# Altium schematic sheet Schematic.SchDoc
size A4
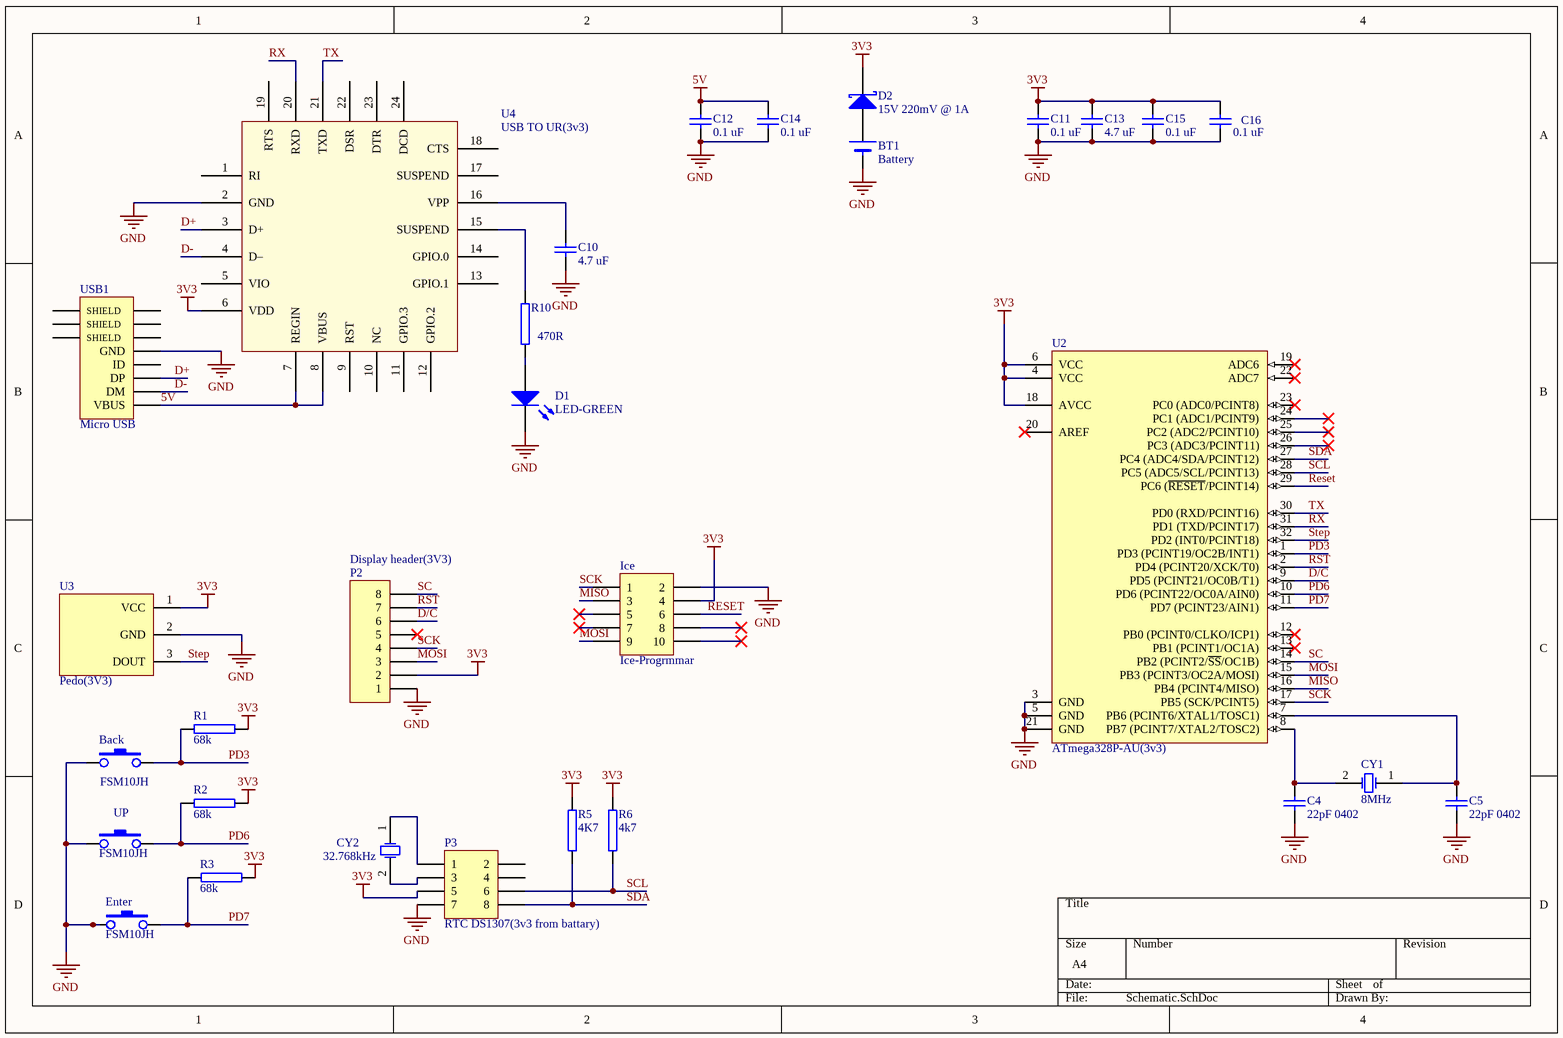
[diagram p0: Schematic.SchDoc]

## Parts
Back  FSM10JH  [FSM10JH]
BT1  Battery  [SMTU 2430-1-LF]
C4  22pF 0402  [CAP_0805]
C5  22pF 0402  [CAP_0805]
C10  4.7 uF  [CAP_0805]
C11  0.1 uF  [CAP_0805]
C12  0.1 uF  [CAP_0805]
C13  4.7 uF  [CAP_0805]
C14  0.1 uF  [CAP_0805]
C15  0.1 uF  [CAP_0805]
C16  0.1 uF  [CAP_0805]
CY1  8MHz  [ABM3]
CY2  32.768kHz  [ABM3]
D1  LED-GREEN  [CAP_0805]
D2  15V 220mV @ 1A  [SOD-128]
Enter  FSM10JH  [FSM10JH]
Ice  Ice-Progrmmar  [SHF-105-01-L-D]
P2  Display header(3V3)  [HDR1X8_AUT]
P3  RTC DS1307(3v3 from battary)  [DIP-8AUT]
R1  68k  [CAP_0805]
R2  68k  [CAP_0805]
R3  68k  [CAP_0805]
R5  4K7  [CAP_0805]
R6  4k7  [CAP_0805]
R10  470R  [CAP_0805]
U2  ATmega328P-AU(3v3)  [32A_M]
U3  Pedo(3V3)  [PCBComponent_1]
U4  USB TO UR(3v3)  [USB_TO_UR_CP1024]
UP  FSM10JH  [FSM10JH]
USB1  Micro USB  [USB-MICRO-B]

## Nets
3V3: C11.2 C13.2 C15.2 C16.2 D2.K Ice.4 P2.2 P3.5 R1.2 R2.2 R3.2 R5.2 R6.2 U2.4(VCC) U2.6(VCC) U2.18(AVCC) U3.1(VCC) U4.6(VDD)
5V: C12.2 C14.2 U4.7(REGIN) U4.8(VBUS) USB1.1(VBUS)
GND: Back.1 BT1.2 C4.1 C5.1 C10.1 C11.1 C12.1 C13.1 C14.1 C15.1 C16.1 D1.K Enter.1 Ice.2 P2.1 P3.7 U2.3(GND) U2.5(GND) U2.21(GND) U3.2(GND) U4.2(GND) UP.1 USB1.5(GND)
D+: U4.3(D+) USB1.3(DP)
D-: U4.4(D–) USB1.2(DM)
D/C: P2.6 U2.9(PD5_(PCINT21/OC0B/T1))
MISO: Ice.3 U2.16(PB4_(PCINT4/MISO))
MOSI: Ice.9 P2.3 U2.15(PB3_(PCINT3/OC2A/MOSI))
PD3: Back.2 R1.1 U2.1(PD3_(PCINT19/OC2B/INT1))
PD6: R2.1 U2.10(PD6_(PCINT22/OC0A/AIN0)) UP.2
PD7: Enter.2 R3.1 U2.11(PD7_(PCINT23/AIN1))
Reset: Ice.6 U2.29(PC6_(~{RESET}/PCINT14))
RST: P2.7 U2.2(PD4_(PCINT20/XCK/T0))
RX: U2.31(PD1_(TXD/PCINT17)) U4.20(RXD)
SC: P2.8 U2.14(PB2_(PCINT2/~{SS}/OC1B))
SCK: Ice.1 P2.4 U2.17(PB5_(SCK/PCINT5))
SCL: P3.6 R6.1 U2.28(PC5_(ADC5/SCL/PCINT13))
SDA: P3.8 R5.1 U2.27(PC4_(ADC4/SDA/PCINT12))
Step: U2.32(PD2_(INT0/PCINT18)) U3.3(DOUT)
TX: U2.30(PD0_(RXD/PCINT16)) U4.21(TXD)
NetC4_2: C4.2 CY1.2(OSC2) U2.8(PB7_(PCINT7/XTAL2/TOSC2))
NetC5_2: C5.2 CY1.1(OSC1) U2.7(PB6_(PCINT6/XTAL1/TOSC1))
NetC10_2: C10.2 U4.16(VPP)
NetCY2_1: CY2.1(OSC1) P3.1
NetCY2_2: CY2.2(OSC2) P3.3
NetD1_A: D1.A R10.1
NetR10_2: R10.2 U4.15(SUSPEND)

Not connected (* = marked no-connect by the designer): BT1 1; D2 A; Ice 5* 7* 8* 10*; P2 5*; P3 2 4; U2 12(PB0_(PCINT0/CLKO/ICP1))* 13(PB1_(PCINT1/OC1A))* 19(ADC6)* 20(AREF)* 22(ADC7)* 23(PC0_(ADC0/PCINT8))* 24(PC1_(ADC1/PCINT9))* 25(PC2_(ADC2/PCINT10))* 26(PC3_(ADC3/PCINT11))*; U4 1(RI) 5(VIO) 9(RST) 10(NC) 11(GPIO.3) 12(GPIO.2) 13(GPIO.1) 14(GPIO.0) 17(SUSPEND) 18(CTS) 19(RTS) 22(DSR) 23(DTR) 24(DCD); USB1 4(ID) 6(SHIELD) 7(SHIELD) 8(SHIELD) 9(SHIELD) 10(SHIELD) 11(SHIELD)

## Library data of the parts
Back Enter UP = FSM10JH: Switch, SPST, 0.05A, 12VDC; Supplier 1: Element14; Supplier Part Number 1: 1555986; SMD: no
BT1 = SMTU 2430-1-LF: HOLDER, SMD BATTERY, FOR CR 2430; Battary: CR2430; Supplier 1: Element14; Supplier Part Number 1: 1216355; SMD: yes
C4 C5 = CAPN 0402: Non Polarized Capacitor, SMD, 0402; Digi-Key Part Number: 399-1113-2-ND; SMD: yes; Supplier 1: Digi-Key; Supplier Part Number 1: 399-1113-2-ND
C10-C16 = CAPN 1206: Non Polarized Capacitor, SMD, 1206; SMD: yes; Footprint: 1206; Supplier 1: Digi-Key
  C10 C13: Digikey Parts Number: *; Supplier Part Number 1: 587-1297-1-ND; Digi-Key Part Number: 587-1297-1-ND
  C11 C12 C14-C16: Supplier Part Number 1: 1276-1007-1-ND; Digi-Key Part Number: 1276-1007-1-ND
CY1 CY2 = ABM3-12.000MHZ-D2Y-T: CRYSTAL, 12MHZ, 18PF, SMD; SMD: yes; Supplier 1: Digi-Key
  CY1: Digi-Key Part Number: 644-1178-1-ND; Supplier Part Number 1: 644-1178-1-ND
  CY2: Digi-Key Part Number: 535-11899-1-ND; Supplier Part Number 1: 535-11899-1-ND
D1 = SMD 0805 LED-GREEN: GREEN  LED,Case 0805; Supplier 1: Digi-Key; Supplier Part Number 1: 475-1410-1-ND; Footprint: 1206; SMD: yes; Digi-Key Part Number: 475-1410-1-ND
D2 = PMEG4050EP: Schottky Diode, 5A, 40v; Supplier 1: Digi-Key; Supplier Part Number 1: LSM115JE3/TR13CT-ND; Digi-Key Part Number: LSM115JE3/TR13CT-ND; SMD: yes
Ice = Mini Box Header 5X2/S: Mini Header, Box, 10 Way, 1.27mm, Straght; Supplier 1: Farnell; Supplier Part Number 1: 2308450; Digikey part num: 1175-1627-ND
P2 = HDR1X8V: Header, Plug, 2.54mm, 8 Pins, Straight; Supplier 1: Element14; Supplier Part Number 1: 2211S-08G; SMD: no
P3 = 2mm Pitch Header 4X2: 2mm Pitch Header, 4-Pin, Dual row; Supplier 1: Element14; Supplier Part Number 1: 1892442; SMD: no
R1-R3 = Resistor 0805: Resistor, SMD, 0805; SMD: yes; Digi-Key Part Number: RMCF0805JT68K0CT-ND; Supplier 1: Digi-Key; Supplier Part Number 1: RMCF0805JT68K0CT-ND
R5 R6 = Resistor 0805: Pull up resister; Digi-Key Part Number: 311-4.70KCRCT-ND; SMD: yes; Supplier 1: Digi-Key; Supplier Part Number 1: 311-4.70KCRCT-ND
R10 = Resistor 1206: Resistor, SMD, 1206; Footprint: 1206; SMD: yes; Supplier 1: Digi-Key; Supplier Part Number 1: RMCF0805JT470RCT-ND; Digi-Key Part Number: RMCF0805JT470RCT-ND
U2 = ATmega328P-AU: 8-bit AVR Microcontroller, 32KB Flash, 1KB EEPROM, 2KB SRAM, 32-pin TQFP, Industrial Grade (-40°C to 85°C); Published: 1-Apr-2010; DatasheetVersion: revA, Jan-2010; PackageVersion: revB, Oct-2001; PackageReference: 32A; Publisher: Altium Limited; PackageDescription: 32-Lead, 7x7x1.0 mm Body, 0.8mm Lead Pitch, Thin Profile Plastic Quad Flat Package (TQFP); Supplier 1: Digi-Key; Supplier Part Number 1: ATMEGA328P-AU-ND; Supplier 2: Farnell; Supplier Part Number 2: 1715486; Supplier 3: Mouser; Supplier Part Number 3: 556-ATMEGA328P-AU; Code_JEDEC: MS-026-ABA; ComponentLink1Description: Manufacturer Link; ComponentLink1URL: http://www.atmel.com/products/avr/default.asp?; ComponentLink2Description: ATmega48A/48PA/88A/88PA/168A/168PA/328/328P Datasheet; ComponentLink2URL: http://www.atmel.com/dyn/resources/prod_documents/8271.pdf; ComponentLink3Description: ATmega48A/48PA/88A/88PA/168A/168PA/328/328P Summary; ComponentLink3URL: http://www.atmel.com/dyn/resources/prod_documents/8271S.pdf; ComponentLink4Description: Atmel.com Home; ComponentLink4URL: http://www.atmel.com; SMD: yes; Digi-Key Part Number: ATMEGA328P-AU-ND
U3 = pedometer: SMD: yes
U4 = USB_TO_UR_CP1024: CP1024; SMD: yes; Supplier 1: Digi-Key; Supplier Part Number 1: CP2014-000-ND; Digi-Key Part Number: CP2014-000-ND
USB1 = USB-Micro-B: Micro USB TYPE B, RECEPTACLE, SMD; Supplier 1: Element14; Supplier Part Number 1: 538-105017-0001; SMD: yes